# EAGLE design main (EAGLE 6.1)
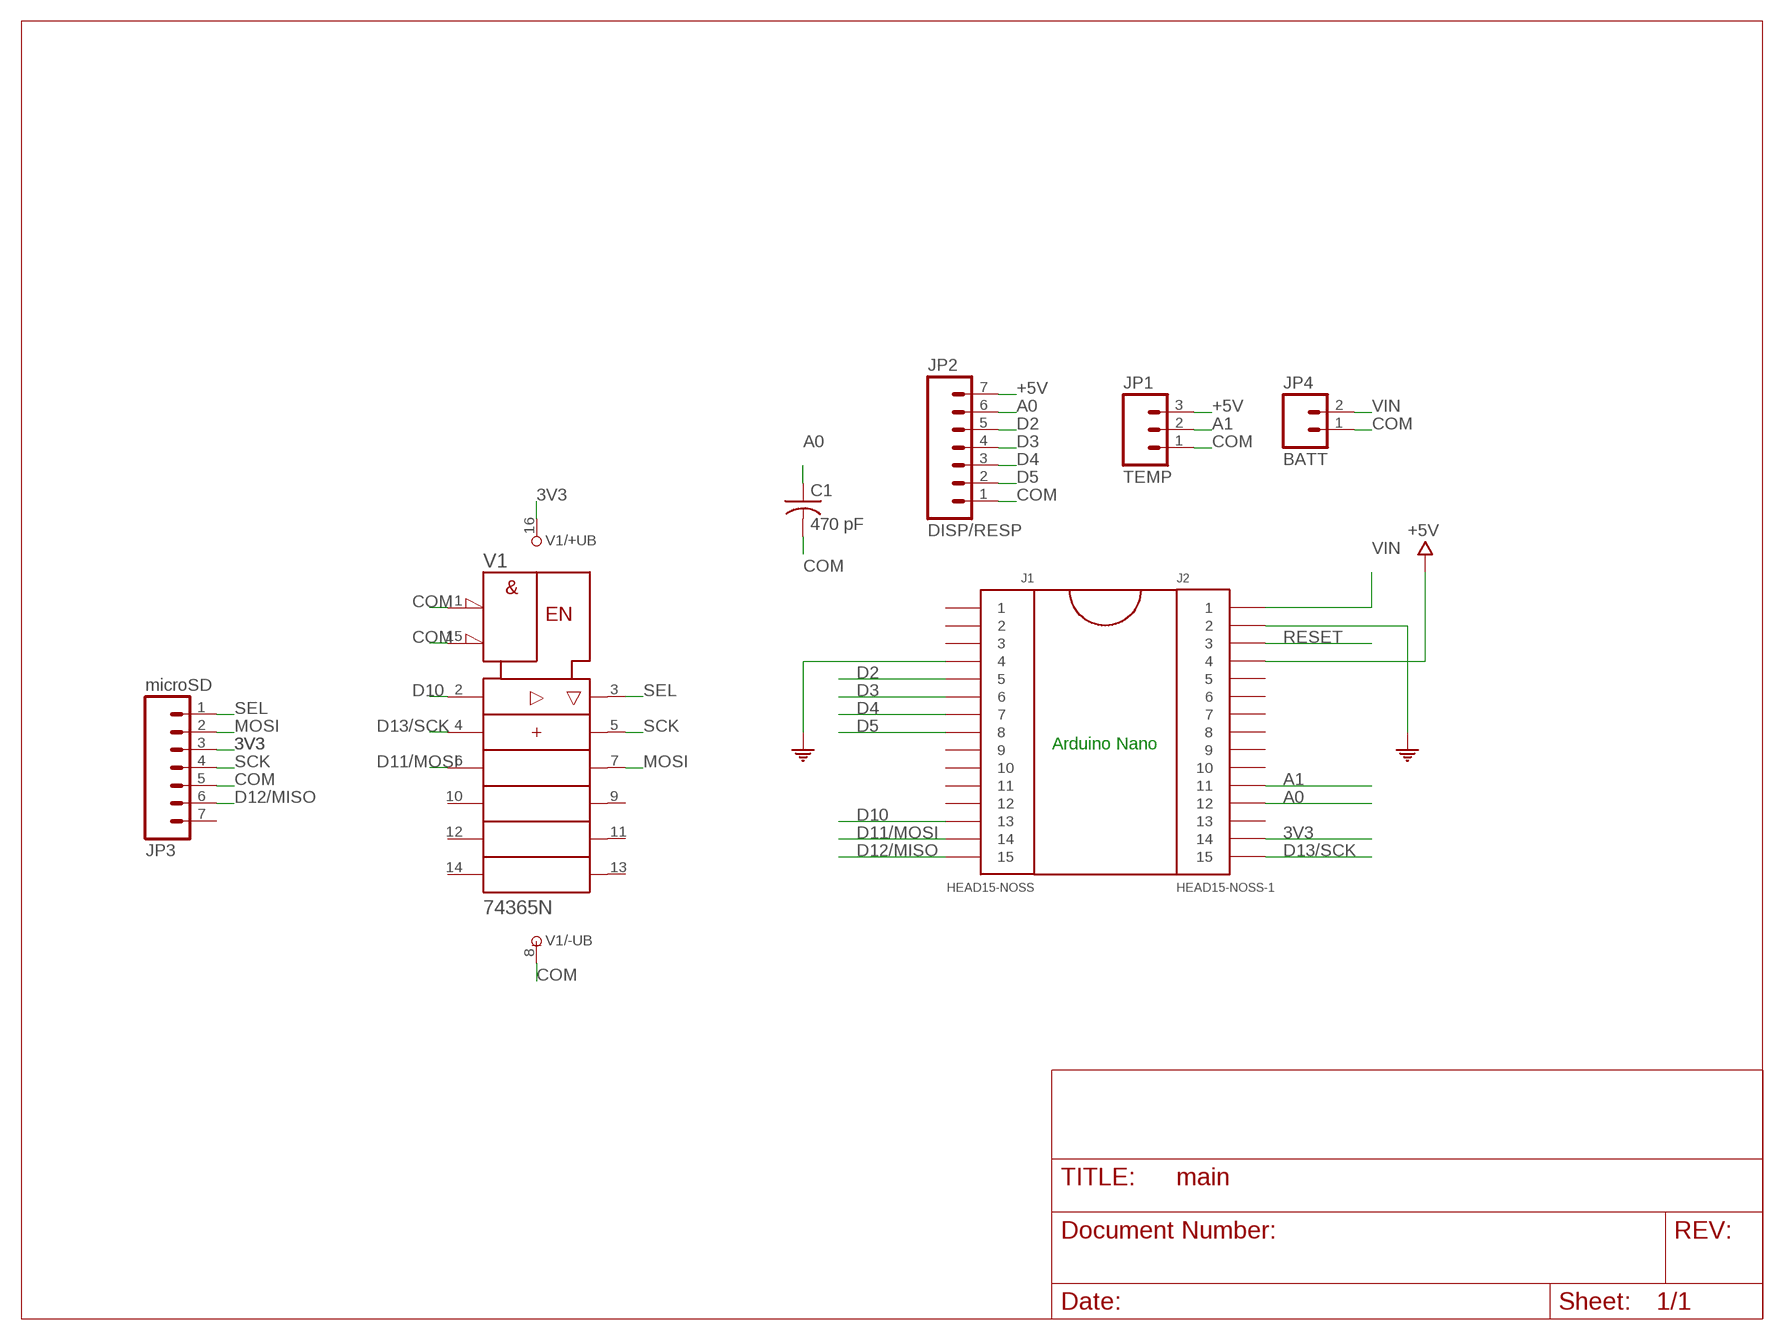
[diagram p0: schematic, sheet 1]

## Parts
C1  470 pF  C-US050-024X044  [C050-024X044]
J1  HEAD15-NOSS  [HEAD15-NOSS]
J2  HEAD15-NOSS-1  [HEAD15-NOSS-1]
JP1  TEMP  M03PTH  [1X03]
JP2  DISP/RESP  M07  [1X07]
JP3  microSD  M07  [1X07]
JP4  BATT  M02PTH  [1X02]
V1  74365N  [DIL16]

## Nets
3V3: J2.14 JP3.3 V1.16(+UB)
+5V: J2.4 JP1.3 JP2.7
A0: C1.1 J2.12 JP2.6
A1: J2.11 JP1.2
COM: C1.2 J1.4 J2.2 JP1.1 JP2.1 JP3.5 JP4.1 V1.1(!G1) V1.8(-UB) V1.15(!G2)
D2: J1.5 JP2.5
D3: J1.6 JP2.4
D4: J1.7 JP2.3
D5: J1.8 JP2.2
D10: J1.13 V1.2(A1)
D11/MOSI: J1.14 V1.6(A3)
D12/MISO: J1.15 JP3.6
D13/SCK: J2.15 V1.4(A2)
MOSI: JP3.2 V1.7(Y3)
RESET: J2.3
SCK: JP3.4 V1.5(Y2)
SEL: JP3.1 V1.3(Y1)
VIN: J2.1 JP4.2
Unconnected: J1.1 J1.2 J1.3 J1.9 J1.10 J1.11 J1.12 J2.5 J2.6 J2.7 J2.8 J2.9 J2.10 J2.13 JP3.7 V1.9(Y4) V1.10(A4) V1.11(Y5) V1.12(A5) V1.13(Y6) V1.14(A6)

## Notes on the sheet
- Arduino Nano

## Library data of the parts
C1 = resistor:C-US: CAPACITOR, American symbol
J1 = MyCON2:HEAD15-NOSS
J2 = MyCON2:HEAD15-NOSS-1
JP1 = SparkFun:M03: Header 3 Standard 3-pin 0.1" header. Use with straight break away headers (SKU : PRT-00116), right angle break away headers (PRT-00553), swiss pins (PRT-00743), machine pins (PRT-00117), and female headers (PRT-00115). Molex polarized connector foot print use with SKU : PRT-08232 with associated crimp pins and housings.
JP2 JP3 = SparkFun:M07: Header 7 Standard 7-pin 0.1" header. Use with straight break away headers (SKU : PRT-00116), right angle break away headers (PRT-00553), swiss pins (PRT-00743), machine pins (PRT-00117), and female headers (PRT-00115). NOTES ON THE VARIANTS LOCK and LOCK_LONGPADS... This footprint was designed to help hold the alignment of a through-hole component (i.e. 7-pin header) while soldering it into place. You may notice that each hole has been shifted either up or down by 0.005 of an inch from it's more standard position (which is usually a perfectly straight line). This slight alteration caused the pins (the squares in the middle) to touch the edges of the holes. Because they are alternating, it causes a "brace" to hold the header in place. 0.005 has proven to be the perfect amount of "off-center" position when using our standard breakaway headers. Although looks a little odd when you look at the bare footprint, once you have a header in there, the alteration is very hard to notice. Also, if you push a header all the way into place, it is covered up entirely on the bottom side. This idea of altering the position of holes to aid alignment will be further integrated into the Sparkfun Library for other footprints. It can help hold any component with 3 or more connection pins.
JP4 = SparkFun:M02: Header 2 Standard 2-pin 0.1" header. Use with straight break away headers (SKU : PRT-00116), right angle break away headers (PRT-00553), swiss pins (PRT-00743), machine pins (PRT-00117), and female headers (PRT-00115). Molex polarized connector foot print use with SKU : PRT-08233 with associated crimp pins and housings.
V1 = 74ttl-din:74*365: Hex BUS DRIVER, 3-state

## Board
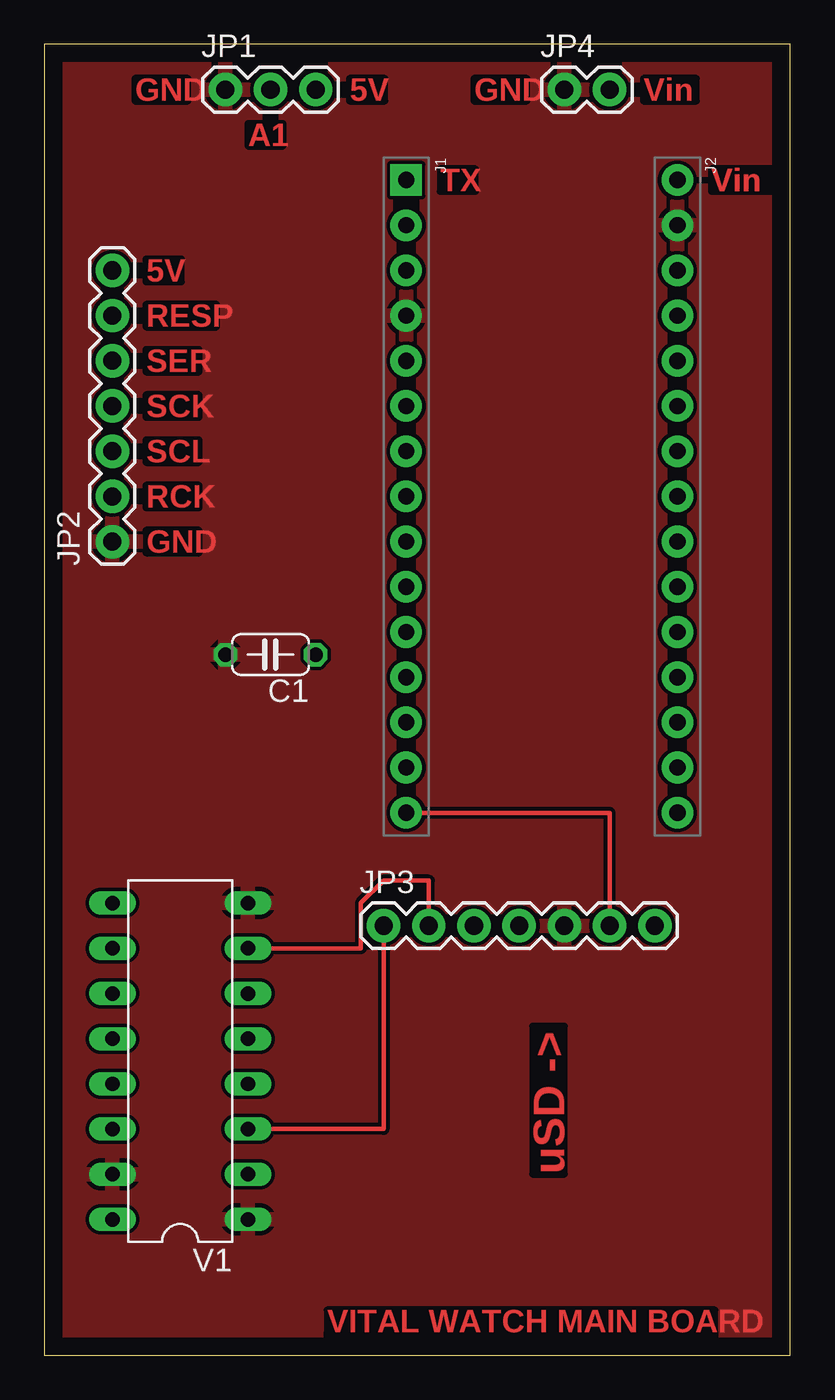
[diagram p1: board, top side]
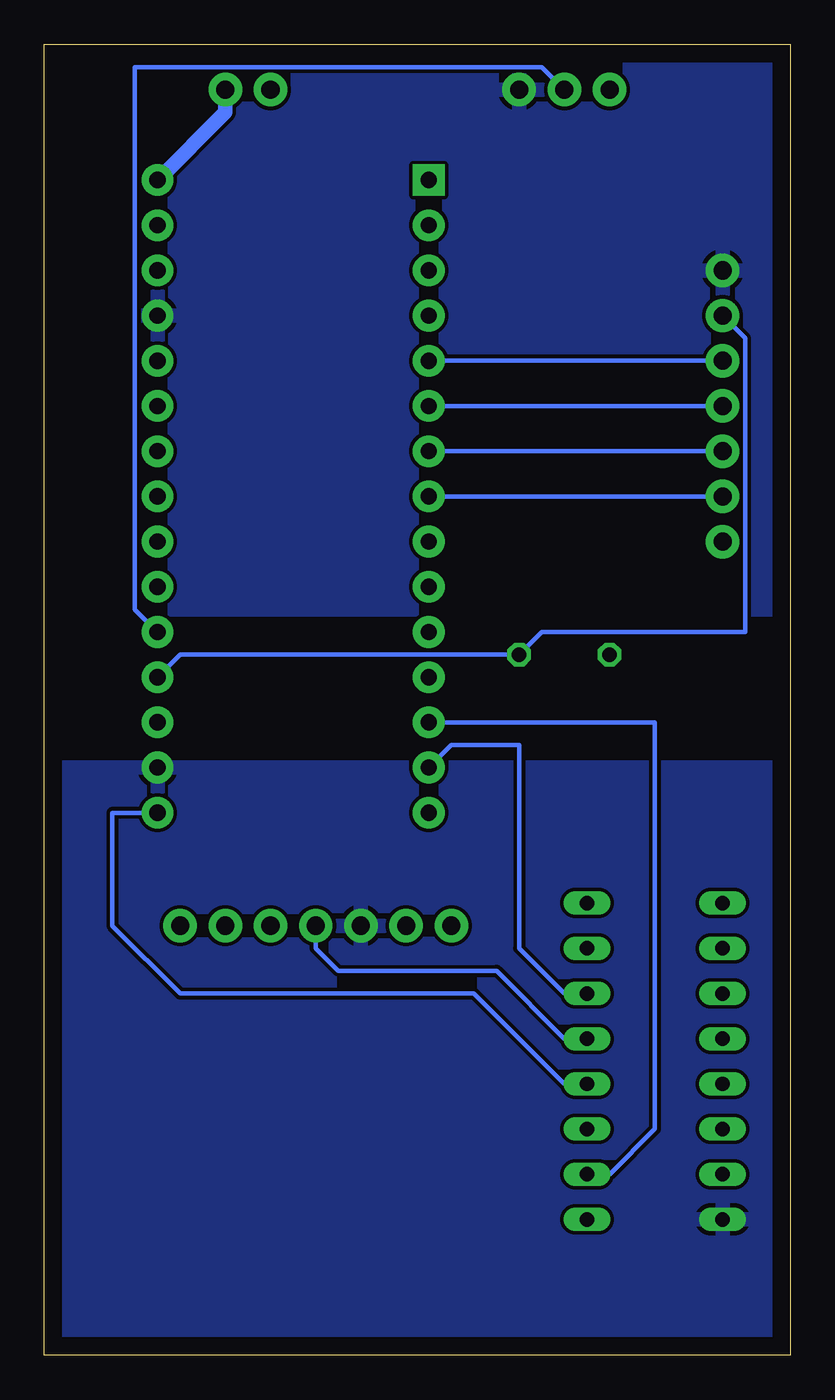
[diagram p2: board, bottom side, seen from below]

Size 41.91 x 73.66 mm. Coordinates in mm from the lower left corner, seen from the top.
Outline: 0,0 41.91,0 41.91,73.66 0,73.66 0,0
Copper layers (1*16): Top 0.035mm / dielectric 1.5mm / Bottom 0.035mm
Design rules: minimum track width 10mil, minimum drill 24mil, track to track 8mil, track to pad 8mil, pad to pad 8mil, via to via 8mil, smd to smd 8mil, copper to edge 40mil, drill to drill 8mil, minimum pad ring 10mil, minimum via ring 8mil, stop-mask expansion 4mil, vias tented up to drill 0mil, thermal gap 10mil

### Footprints (pad centres in the part's own frame; a part is rotated, then mirrored left to right if it is on the bottom)
C050-024X044 = drill 0.813 octagon: 1 -2.54,0; 2 2.54,0
HEAD15-NOSS = drill 0.914 pad 1.778 square: 1 0,0 | drill 0.914 pad 1.778: 2 2.54,0; 3 5.08,0; 4 7.62,0; 5 10.16,0; 6 12.7,0; 7 15.24,0; 8 17.78,0; 9 20.32,0; 10 22.86,0; 11 25.4,0; 12 27.94,0; 13 30.48,0; 14 33.02,0; 15 35.56,0
HEAD15-NOSS-1 = drill 0.914 pad 1.778: 1 0,0; 2 2.54,0; 3 5.08,0; 4 7.62,0; 5 10.16,0; 6 12.7,0; 7 15.24,0; 8 17.78,0; 9 20.32,0; 10 22.86,0; 11 25.4,0; 12 27.94,0; 13 30.48,0; 14 33.02,0; 15 35.56,0
1X03 = drill 1.016 pad 1.88: 1 0,0; 2 2.54,0; 3 5.08,0
1X07 = drill 1.016 pad 1.88: 1 0,0; 2 2.54,0; 3 5.08,0; 4 7.62,0; 5 10.16,0; 6 12.7,0; 7 15.24,0
1X02 = drill 1.016 pad 1.88: 1 0,0; 2 2.54,0
DIL16 = drill 0.813 long: 1 -8.89,-3.81; 2 -6.35,-3.81; 3 -3.81,-3.81; 4 -1.27,-3.81; 5 1.27,-3.81; 6 3.81,-3.81; 7 6.35,-3.81; 8 8.89,-3.81; 9 8.89,3.81; 10 6.35,3.81; 11 3.81,3.81; 12 1.27,3.81; 13 -1.27,3.81; 14 -3.81,3.81; 15 -6.35,3.81; 16 -8.89,3.81

### Placement (x,y rotation side)
C1  12.7,39.37 180 top
J1  20.32,66.04 270 top
J2  35.56,66.04 270 top
JP1  10.16,71.12 0 top
JP2  3.81,45.72 90 top
JP3  19.05,24.13 0 top
JP4  29.21,71.12 0 top
V1  7.62,16.51 90 top

### Tracks (layer width: path | path; a pad name or v marks a point on that pad's centre or on a via)
3V3
  pour Bottom: 0,33.02 41.91,33.02 41.91,0 0,0
+5V
  pour Bottom: 0,73.66 40.64,73.66 40.64,41.91 0,41.91
A0
  Bottom 0.254: J2.12 34.29,39.37 C1.1 13.97,40.64 2.54,40.64 2.54,57.15 JP2.6
A1
  Bottom 0.254: J2.11 36.83,41.91 36.83,72.39 13.97,72.39 JP1.2
COM
  pour Top: 0,0 0,73.66 41.91,73.66 41.91,0
D2
  Bottom 0.254: JP2.5 J1.5
D3
  Bottom 0.254: JP2.4 J1.6
D4
  Bottom 0.254: JP2.3 J1.7
D5
  Bottom 0.254: JP2.2 J1.8
D10
  Bottom 0.254: V1.2 10.16,10.16 7.62,12.7 7.62,35.56 J1.13
D11/MOSI
  Bottom 0.254: V1.6 12.7,20.32 15.24,22.86 15.24,34.29 19.05,34.29 J1.14
D12/MISO
  Top 0.254: J1.15 31.75,30.48 JP3.6
D13/SCK
  Bottom 0.254: V1.4 12.7,15.24 17.78,20.32 34.29,20.32 38.1,24.13 38.1,30.48 J2.15
MOSI
  Top 0.254: V1.7 17.78,22.86 17.78,25.4 19.05,26.67 21.59,26.67 JP3.2
SCK
  Bottom 0.254: V1.5 12.7,17.78 16.51,21.59 25.4,21.59 26.67,22.86 JP3.4
SEL
  Top 0.254: V1.3 19.05,12.7 JP3.1
VIN
  Bottom 0.813: JP4.2 31.75,69.85 J2.1

### Text on the board
Top: GND | 5V | GND | Vin | A1 | TX | Vin | Vin | 5V | RESP | SER | SCK | SCL | RCK | GND | uSD -> | VITAL WATCH MAIN BOARD